# Altium schematic sheet BLDC.SchDoc
size Letter; ENG_APP_DATE: --/--/--; DSN_APP_DATE: --/--/--; CHK_APP_DATE: --/--/--
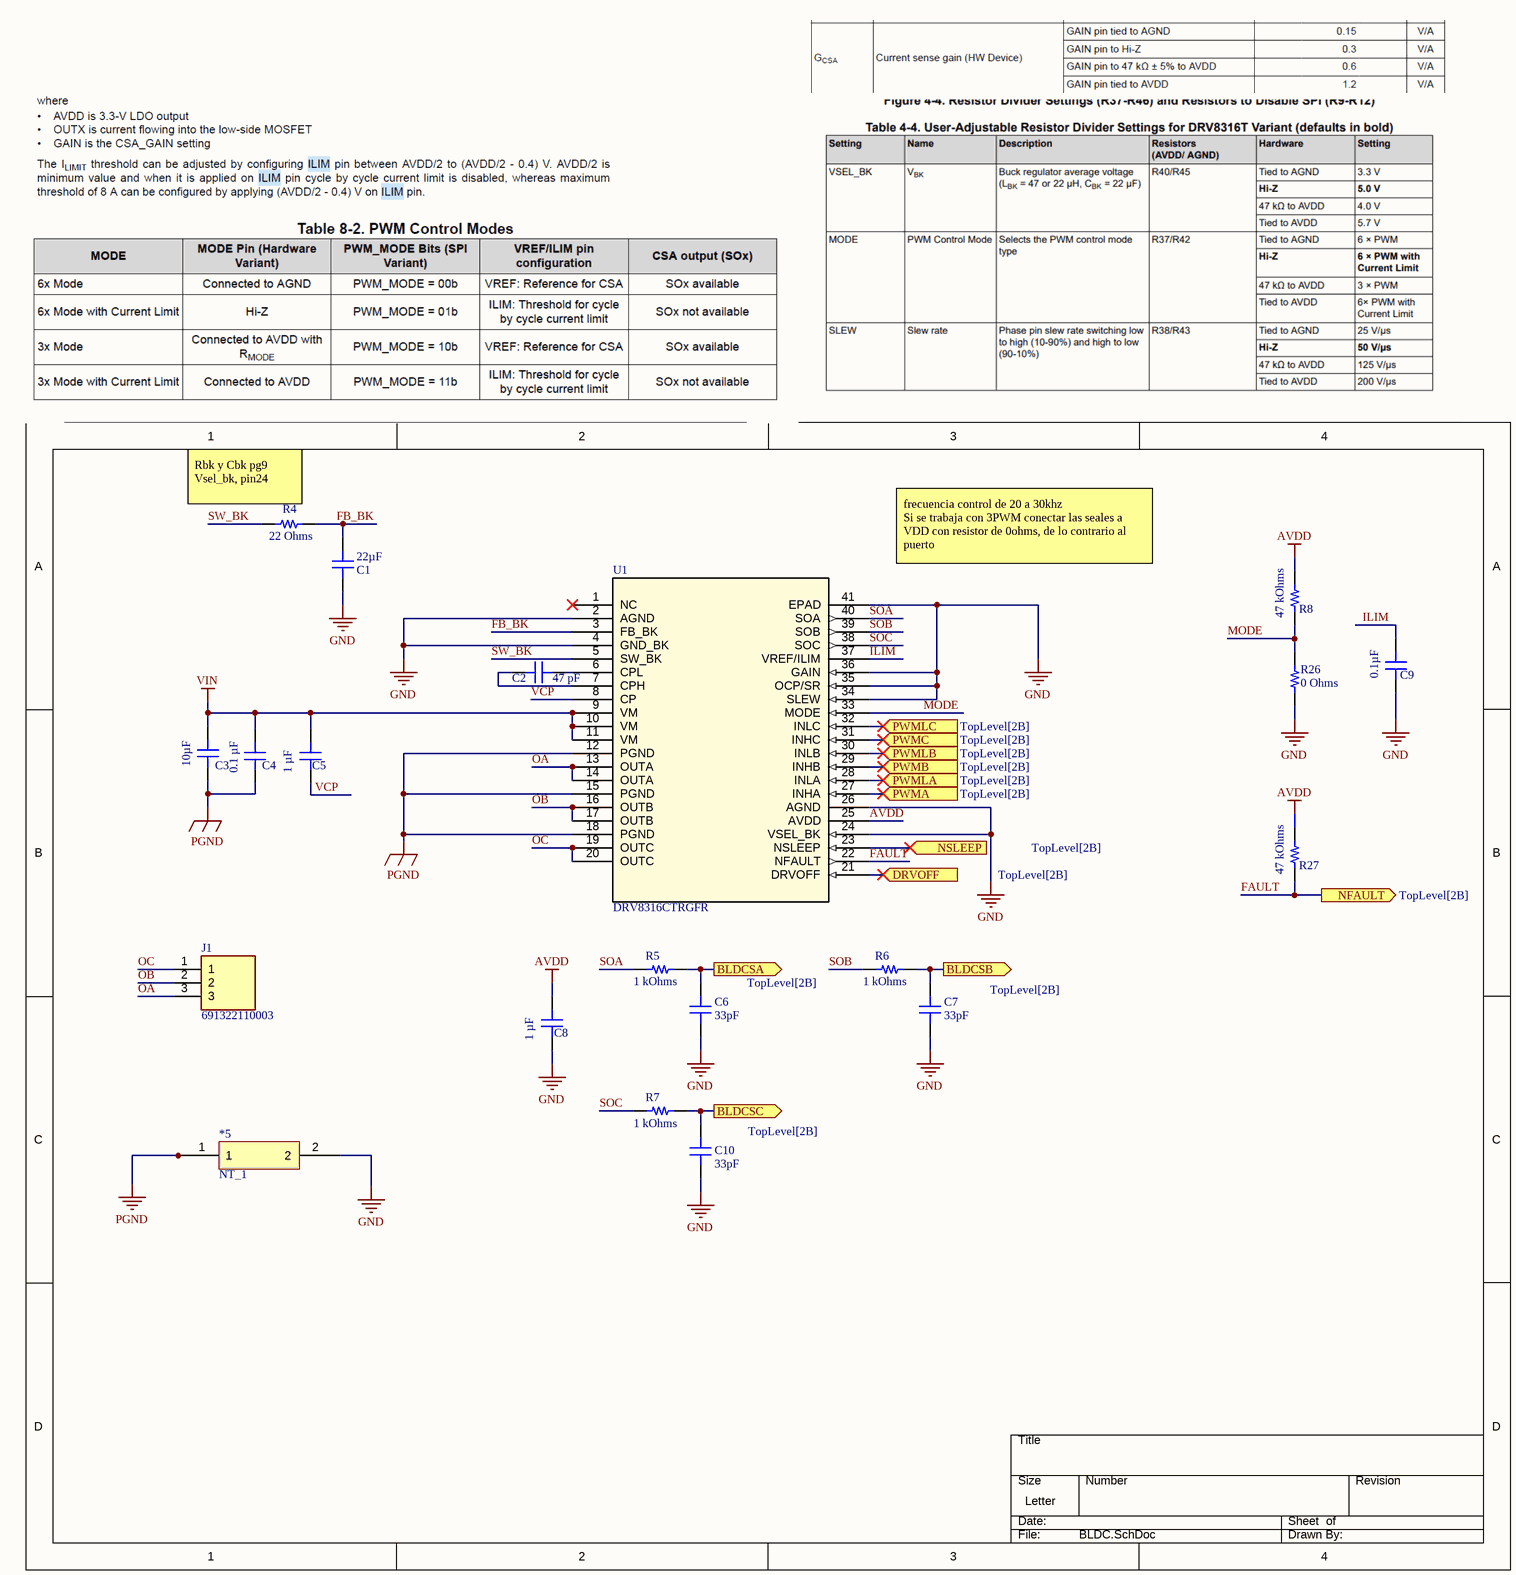
[diagram p0: BLDC.SchDoc]

## Parts
*5  NT_1  [Net_Tie]  (net tie, no BOM)
C1  22µF  [CAP 0805_2012]
C2  47 pF  [CAP 0805_2012]
C3  10µF  [CAP 1210_3225 - 2.8MM]
C4  0.1 µF  [CAP 0603_1608]
C5  Capacitance: 1 µF  [CAP 0805_2012]
C6  33pF  [CAP 0603_1608]
C7  33pF  [CAP 0603_1608]
C8  Capacitance: 1 µF  [CAP 0805_2012]
C9  Capacitance: 0.1µF  [CAP 0805_2012]
C10  33pF  [CAP 0603_1608]
J1  691322110003  [SHDRRA3W80P0X350_1X3_1190X920X700P]
R4  22 Ohms  [YAGEO RES 0603_1608]
R5  1 kOhms  [YAGEO RES 0603_1608]
R6  1 kOhms  [YAGEO RES 0603_1608]
R7  1 kOhms  [YAGEO RES 0603_1608]
R8  47 kOhms  [YAGEO RES 0603_1608]
R26  0 Ohms  [YAGEO RES 0603_1608]
R27  47 kOhms  [YAGEO RES 0603_1608]
U1  DRV8316CTRGFR  [VQFN40_RGF_TEX]

## Ports
BLDCSA (out, see TopLevel[2B]), BLDCSB (out, see TopLevel[2B]), BLDCSC (out, see TopLevel[2B]), DRVOFF (in, see TopLevel[2B]), NFAULT (out, see TopLevel[2B]), NSLEEP (in, see TopLevel[2B]), PWMA (in, see TopLevel[2B]), PWMB (in, see TopLevel[2B]), PWMC (in, see TopLevel[2B]), PWMLA (in, see TopLevel[2B]), PWMLB (in, see TopLevel[2B]), PWMLC (in, see TopLevel[2B])

## Nets
AVDD: C8.1 R8.2 R27.2 U1.25(AVDD)
GND: *5.2 C1.2 C6.1 C7.1 C8.2 C9.2 C10.1 R26.2 U1.2(AGND) U1.4(GND_BK) U1.24(VSEL_BK) U1.26(AGND) U1.34(SLEW) U1.35(OCP/SR) U1.36(GAIN) U1.41(EPAD)
PGND: *5.1 C3.1 C4.2 U1.12(PGND) U1.15(PGND) U1.18(PGND)
VIN: C3.2 C4.1 C5.1 U1.9(VM) U1.10(VM) U1.11(VM)
BLDCSA: C6.2 R5.2 ; port BLDCSA
BLDCSB: C7.2 R6.2 ; port BLDCSB
BLDCSC: C10.2 R7.2 ; port BLDCSC
DRVOFF: U1.21(DRVOFF) ; port DRVOFF
FAULT: R27.1 U1.22(NFAULT) ; port NFAULT
FB_BK: C1.1 R4.2 U1.3(FB_BK)
ILIM: C9.1 U1.37(VREF/ILIM)
MODE: R8.1 R26.1 U1.33(MODE)
NSLEEP: U1.23(NSLEEP) ; port NSLEEP
OA: J1.3 U1.13(OUTA) U1.14(OUTA)
OB: J1.2 U1.16(OUTB) U1.17(OUTB)
OC: J1.1 U1.19(OUTC) U1.20(OUTC)
PWMA: U1.27(INHA) ; port PWMA
PWMB: U1.29(INHB) ; port PWMB
PWMC: U1.31(INHC) ; port PWMC
PWMLA: U1.28(INLA) ; port PWMLA
PWMLB: U1.30(INLB) ; port PWMLB
PWMLC: U1.32(INLC) ; port PWMLC
SOA: R5.1 U1.40(SOA)
SOB: R6.1 U1.39(SOB)
SOC: R7.1 U1.38(SOC)
SW_BK: R4.1 U1.5(SW_BK)
VCP: C5.2 U1.8(CP)
NetC2_1: C2.1 U1.7(CPH)
NetC2_2: C2.2 U1.6(CPL)

Not connected (* = marked no-connect by the designer): U1 1(NC)*

## Notes on the sheet
- (near R4) Rbk y Cbk pg9
  Vsel_bk, pin24
- frecuencia control de 20 a 30khz
  Si se trabaja con 3PWM conectar las seales a VDD con resistor de 0ohms, de lo contrario al puerto
- DWG. NO.
- REV.
- SHT.
- REVISION
- DESCRIPTION
- DATE
- APPROVED
- THIS DOCUMENT AND THE DATA DISCLOSED HEREIN OR HEREWITH IS THE PROPERTY OF ALTIUM LIMITED AND MAY BE FREELY DISTRIBUTED IN WHOLE. NO RIGHTS ARE RESERVED OR EXPRESS OR IMPLIED WARANTEE GIVEN.
- ENG:
- DSN:
- APPROVALS
- PROJECT
- DOCUMENT REVISION:
- DESIGN ITEM:
- CHK:
- BOM:
- REFERENCE DOCUMENTS
- PROJECT REVISION:
- TITLE
- FAB DWG:
- PCB DWG:
- ASSY DWG:
- SCALE:
- SIZE
- C
- CAGE CODE
- FILE NAME
- DWG NO.
- SHEET
- OF
- REV

## Library data of the parts
C1 = 0805ZD226MAT2A: CAP CER 22UF 10V X5R 0805; manufacturer: AVX Corporation; Tolerance: ±20%; value: 22µF; Part Number: 0805ZD226MAT2A; Applications: General Purpose; componentlink1description: Datasheet; componentlink1url: http://datasheets.avx.com/cx5r.pdf; componentlink2description: DigiKey Link; componentlink2url: http://digikey.com/product-detail/en/avx-corporation/0805ZD226MAT2A/478-7966-1-ND/3881589; Device Package: 0805 (2012 Metric); lastupdated: 2020-09-02 01:04:32; Lifecycle Status: Active; Minimum Order: 1; Mounting Type: Surface Mount, MLCC; Operating Temperature: -55°C ~ 85°C; Package / Case: 0805 (2012 Metric); packaging: TapeAndReel; partid: 7750; Part Status: Active; price: 0.10; series: -; Size / Dimension: 0.079" L x 0.049" W (2.00mm x 1.25mm); Supplier 1: DigiKey; Supplier Part Number 1: 478-7966-1-ND; Temperature Coefficient: X5R; Thickness (Max): 0.060" (1.52mm); Voltage - Rated: 10V
C2 = AC0805JRNPO9BN470: CAP CER 47PF 50V C0G/NPO 0805; manufacturer: Yageo; Tolerance: ±5%; Temperature Coefficient: C0G, NP0; value: 47 pF; Part Number: AC0805JRNPO9BN470; Applications: Automotive; componentlink1description: Datasheet; componentlink1url: http://www.yageo.com/NewPortal/_en/search/productDocs.jsp?YageoPartNumber=AC0805JRNPO9BN470; componentlink2description: DigiKey Link; componentlink2url: https://www.digikey.com/en/products/detail/yageo/AC0805JRNPO9BN470/6643124; Device Package: 0805 (2012 Metric); lastupdated: 2024-02-09 20:15:29; Lifecycle Status: Active; Minimum Order: 1; Mounting Type: Surface Mount, MLCC; Operating Temperature: -55°C ~ 125°C; Package / Case: 0805 (2012 Metric); packaging: TapeAndReel; partid: 16022; Part Status: Active; price: 0.02; Ratings: AEC-Q200; series: AC; Size / Dimension: 0.079" L x 0.049" W (2.00mm x 1.25mm); Supplier 1: DigiKey; Supplier Part Number 1: 311-3138-1-ND; Thickness (Max): 0.028" (0.70mm); Voltage - Rated: 50V
C3 = 1210DD106KAT2A: CAP CER 10UF 35V X5R 1210; manufacturer: AVX Corporation; Tolerance: ±10%; Value: 10µF; componentlink2description: DigiKey Link; componentlink2url: http://digikey.com/product-detail/en/avx-corporation/1210DD106KAT2A/478-12271-1-ND/9565678; Temperature Coefficient: X5R; Capacitance: 10µF; Part Number: 1210DD106KAT2A; Applications: General Purpose; componentlink1description: Datasheet; componentlink1url: http://datasheets.avx.com/cx5r.pdf; Device Package: 1210 (3225 Metric); lastupdated: 2020-09-02 01:10:50; Lifecycle Status: Active; Minimum Order: 1; Mounting Type: Surface Mount, MLCC; Operating Temperature: -55°C ~ 85°C; Package / Case: 1210 (3225 Metric); packaging: TapeAndReel; partid: 23974; Part Status: Active; price: 0.66; series: -; Size / Dimension: 0.126" L x 0.098" W (3.20mm x 2.50mm); Supplier 1: DigiKey; Supplier Part Number 1: 478-12271-1-ND; Thickness (Max): 0.110" (2.79mm); Voltage - Rated: 35V
C4 = GMJ107BB7104KAHT: CAP CER 0.1UF 35V X7R 0603; manufacturer: Taiyo Yuden; Tolerance: ±10%; value: 0.1 µF; Part Number: GMJ107BB7104KAHT; Applications: Automotive, Boardflex Sensitive; componentlink1description: Datasheet; componentlink1url: https://ds.yuden.co.jp/TYCOMPAS/ut/detail?pn=GMJ107BB7104KAHT &u=M; componentlink2description: DigiKey Link; componentlink2url: https://www.digikey.com/en/products/detail/taiyo-yuden/GMJ107BB7104KAHT/5880015; Device Package: 0603 (1608 Metric); Features: Soft Termination; lastupdated: 2024-02-09 20:10:10; Lifecycle Status: Active; Minimum Order: 1; Mounting Type: Surface Mount, MLCC; Operating Temperature: -55°C ~ 125°C; Package / Case: 0603 (1608 Metric); packaging: TapeAndReel; partid: 16165; Part Status: Active; price: 0.04; Ratings: AEC-Q200; series: M; Size / Dimension: 0.063" L x 0.031" W (1.60mm x 0.80mm); Supplier 1: DigiKey; Supplier Part Number 1: 587-4467-1-ND; Temperature Coefficient: X7R; Thickness (Max): 0.039" (1.00mm); Voltage - Rated: 35V
C5 C8 = CC0805MKY5V9BB105: CAP CER 1UF 50V Y5V 0805; manufacturer: Yageo; Tolerance: ±20%; Temperature Coefficient: Y5V (F); Part Number: CC0805MKY5V9BB105; Applications: General Purpose; componentlink1description: Datasheet; componentlink1url: http://www.yageo.com/documents/recent/UPY-GPHC_Y5V_6.3V-to-50V_8.pdf; componentlink2description: DigiKey Link; componentlink2url: https://www.digikey.com/en/products/detail/yageo/CC0805MKY5V9BB105/5884272; Device Package: 0805 (2012 Metric); lastupdated: 2024-02-09 20:15:56; Lifecycle Status: Active; Minimum Order: 1; Mounting Type: Surface Mount, MLCC; Operating Temperature: -30°C ~ 85°C; Package / Case: 0805 (2012 Metric); packaging: TapeAndReel; partid: 7367; Part Status: Active; price: 0.03; series: CC; Size / Dimension: 0.079" L x 0.049" W (2.00mm x 1.25mm); Supplier 1: DigiKey; Supplier Part Number 1: 311-3435-1-ND; Thickness (Max): 0.057" (1.45mm); Voltage - Rated: 50V
C6 C7 C10 = 0603YC330JAT2A: CAP CER 33PF 16V X7R 0603; manufacturer: AVX Corporation; Tolerance: ±5%; value: 33pF; Part Number: 0603YC330JAT2A; Applications: General Purpose; componentlink1description: Datasheet; componentlink1url: http://datasheets.avx.com/X7RDielectric.pdf; componentlink2description: DigiKey Link; componentlink2url: http://digikey.com/product-detail/en/avx-corporation/0603YC330JAT2A/478-6211-1-ND/2391410; Device Package: 0603 (1608 Metric); lastupdated: 2020-09-02 01:03:19; Lifecycle Status: Active; Minimum Order: 1; Mounting Type: Surface Mount, MLCC; Operating Temperature: -55°C ~ 125°C; Package / Case: 0603 (1608 Metric); packaging: TapeAndReel; partid: 11539; Part Status: Active; price: 0.03; series: -; Size / Dimension: 0.063" L x 0.032" W (1.60mm x 0.81mm); Supplier 1: DigiKey; Supplier Part Number 1: 478-6211-1-ND; Temperature Coefficient: X7R; Thickness (Max): 0.035" (0.90mm); Voltage - Rated: 16V
C9 = 08053E104ZAT2A: CAP CER 0.1UF 25V Z5U 0805; manufacturer: AVX Corporation; Tolerance: -20%, +80%; Part Number: 08053E104ZAT2A; Applications: General Purpose; componentlink2description: DigiKey Link; componentlink2url: http://digikey.com/product-detail/en/avx-corporation/08053E104ZAT2A/478-12769-1-ND/9949310; Device Package: 0805 (2012 Metric); lastupdated: 2020-09-02 01:04:40; Lifecycle Status: Active; Minimum Order: 1; Mounting Type: Surface Mount, MLCC; Operating Temperature: 10°C ~ 85°C; Package / Case: 0805 (2012 Metric); packaging: TapeAndReel; partid: 3602; Part Status: Active; price: 0.04; series: -; Size / Dimension: 0.079" L x 0.049" W (2.00mm x 1.25mm); Supplier 1: DigiKey; Supplier Part Number 1: 478-12769-1-ND; Temperature Coefficient: Z5U; Thickness (Max): 0.037" (0.94mm); Voltage - Rated: 25V
J1 = 691322110003: Pluggable Terminal Block Wurth Elektronik 3221 Series 3.5mm Pitch, 3 Way Straight, PCB Header, Through Hole; Geometry.Height: 7mm; Manufacturer_Name: Wurth Elektronik; Manufacturer_Part_Number: 691322110003; Mouser Part Number: 710-691322110003; Mouser Price/Stock: https://www.mouser.co.uk/ProductDetail/Wurth-Elektronik/691322110003?qs=E2PpAYvlWVuH5qLC1GE%2FCQ%3D%3D; Arrow Part Number: *; Arrow Price/Stock: *; Datasheet Link: http://katalog.we-online.de/em/datasheet/6913221100xx.pdf
R4 = AC0603FR-0722RL: RES SMD 22 OHM 1% 1/10W 0603; Manufacturer: Yageo; Power (Watts): 0.1W, 1/10W; Temperature Coefficient: ±100ppm/°C; Tolerance: ±1%; Value: 22 Ohms; Part Number: AC0603FR-0722RL; ComponentLink1Description: Datasheet; ComponentLink1URL: https://www.yageo.com/upload/media/product/productsearch/datasheet/rchip/PYu-AC_51_RoHS_L_7.pdf; ComponentLink2Description: DigiKey Link; ComponentLink2URL: https://www.digikey.com/en/products/detail/yageo/AC0603FR-0722RL/5895927; Composition: Thick Film; Device Package: 0603 (1608 Metric); Features: Automotive AEC-Q200, Moisture Resistant; Height - Seated (Max): 0.022" (0.55mm); LastUpdated: 2024-07-25 09:19:25; Lifecycle Status: Active; Minimum Order: 1; Number of Terminations: 2; Operating Temperature: -55°C ~ 155°C; Package / Case: 0603 (1608 Metric); Packaging: CutTape; PartId: 16487; Part Status: Active; Price: 0.01; Ratings: AEC-Q200; Resistance: 22 Ohms; Series: AC; Size / Dimension: 0.063" L x 0.031" W (1.60mm x 0.80mm); Supplier 1: DigiKey; Supplier Part Number 1: YAG3581CT-ND; Supplier Device Package: 0603
R5-R7 = AT0603DRD071KL: RES SMD 1K OHM 0.5% 1/10W 0603; Manufacturer: Yageo; Power (Watts): 0.1W, 1/10W; Temperature Coefficient: ±25ppm/°C; Part Number: AT0603DRD071KL; Value: 1 kOhms; ComponentLink1Description: Datasheet; ComponentLink1URL: http://www.yageo.com/documents/recent/PYu-AT_51_RoHS_L_5.pdf; ComponentLink2Description: DigiKey Link; ComponentLink2URL: https://www.digikey.com/en/products/detail/yageo/AT0603DRD071KL/5138634; Composition: Thin Film; Device Package: 0603 (1608 Metric); Features: Anti-Sulfur, Automotive AEC-Q200, Moisture Resistant; Height - Seated (Max): 0.022" (0.55mm); LastUpdated: 2024-07-25 09:19:32; Lifecycle Status: Active; Minimum Order: 1; Number of Terminations: 2; Operating Temperature: -55°C ~ 155°C; Package / Case: 0603 (1608 Metric); Packaging: TapeAndReel; PartId: 4899; Part Status: Active; Price: 0.02; Ratings: AEC-Q200; Resistance: 1 kOhms; Series: AT; Size / Dimension: 0.063" L x 0.031" W (1.60mm x 0.80mm); Supplier 1: DigiKey; Supplier Part Number 1: YAG2115CT-ND; Supplier Device Package: 0603; Tolerance: ±0.5%
R8 R27 = RT0603FRE0747KL: RES SMD 47K OHM 1% 1/10W 0603; Manufacturer: Yageo; Power (Watts): 0.1W, 1/10W; Temperature Coefficient: ±50ppm/°C; Tolerance: ±1%; Value: 47 kOhms; Part Number: RT0603FRE0747KL; ComponentLink1Description: Datasheet; ComponentLink1URL: https://www.yageo.com/upload/media/product/productsearch/datasheet/rchip/PYu-RT_1-to-0.01_RoHS_L_11.pdf; ComponentLink2Description: DigiKey Link; ComponentLink2URL: https://www.digikey.com/en/products/detail/yageo/RT0603FRE0747KL/1075386; Composition: Thin Film; Device Package: 0603 (1608 Metric); Height - Seated (Max): 0.022" (0.55mm); LastUpdated: 2024-07-25 09:19:32; Lifecycle Status: Active; Minimum Order: 1; Number of Terminations: 2; Operating Temperature: -55°C ~ 155°C; Package / Case: 0603 (1608 Metric); Packaging: TapeAndReel; PartId: 5674; Part Status: Active; Price: 0.01; Resistance: 47 kOhms; Series: RT; Size / Dimension: 0.063" L x 0.031" W (1.60mm x 0.80mm); Supplier 1: DigiKey; Supplier Part Number 1: YAG3355CT-ND; Supplier Device Package: 0603
R26 = RC0603FR-100RL: RES 0 OHM JUMPER 1/10W 0603; Manufacturer: Yageo; Part Number: RC0603FR-100RL; Value: 0 Ohms; ComponentLink1Description: Datasheet; ComponentLink1URL: https://www.yageo.com/upload/media/product/productsearch/datasheet/rchip/PYu-RC_Group_51_RoHS_L_12.pdf; ComponentLink2Description: DigiKey Link; ComponentLink2URL: https://www.digikey.com/en/products/detail/yageo/RC0603FR-100RL/1303802; Composition: Thick Film; Device Package: 0603 (1608 Metric); Features: Moisture Resistant; Height - Seated (Max): 0.022" (0.55mm); LastUpdated: 2024-07-25 09:19:04; Lifecycle Status: Active; Minimum Order: 1; Number of Terminations: 2; Operating Temperature: -55°C ~ 155°C; Package / Case: 0603 (1608 Metric); Packaging: CutTape; PartId: 77830; Part Status: Active; Price: 0.01; Resistance: 0 Ohms; Series: RC_L; Size / Dimension: 0.063" L x 0.031" W (1.60mm x 0.80mm); Supplier 1: DigiKey; Supplier Part Number 1: 13-RC0603FR-100RLCT-ND; Supplier Device Package: 0603; Tolerance: Jumper
U1 = DRV8316CTRGFR: No Description Available; Mfr_Name: Texas Instruments; Type: DEV; Copyright: Copyright (C) 2024 Ultra Librarian. All rights reserved.; Manufacturer_Part_Number: DRV8316CTRGFR; RefDes: RefDes